# EasyEDA Pro project 平衡小车源文件.epro

# Schematic Schematic1
Create Date: 2024-05-30; Page Name: P1; Project Name: 平衡小车; Schematic Name: Schematic1; Update Date: 2024-05-30; Company: 嘉立创EDA; Page Size: A4; Version: V1.0
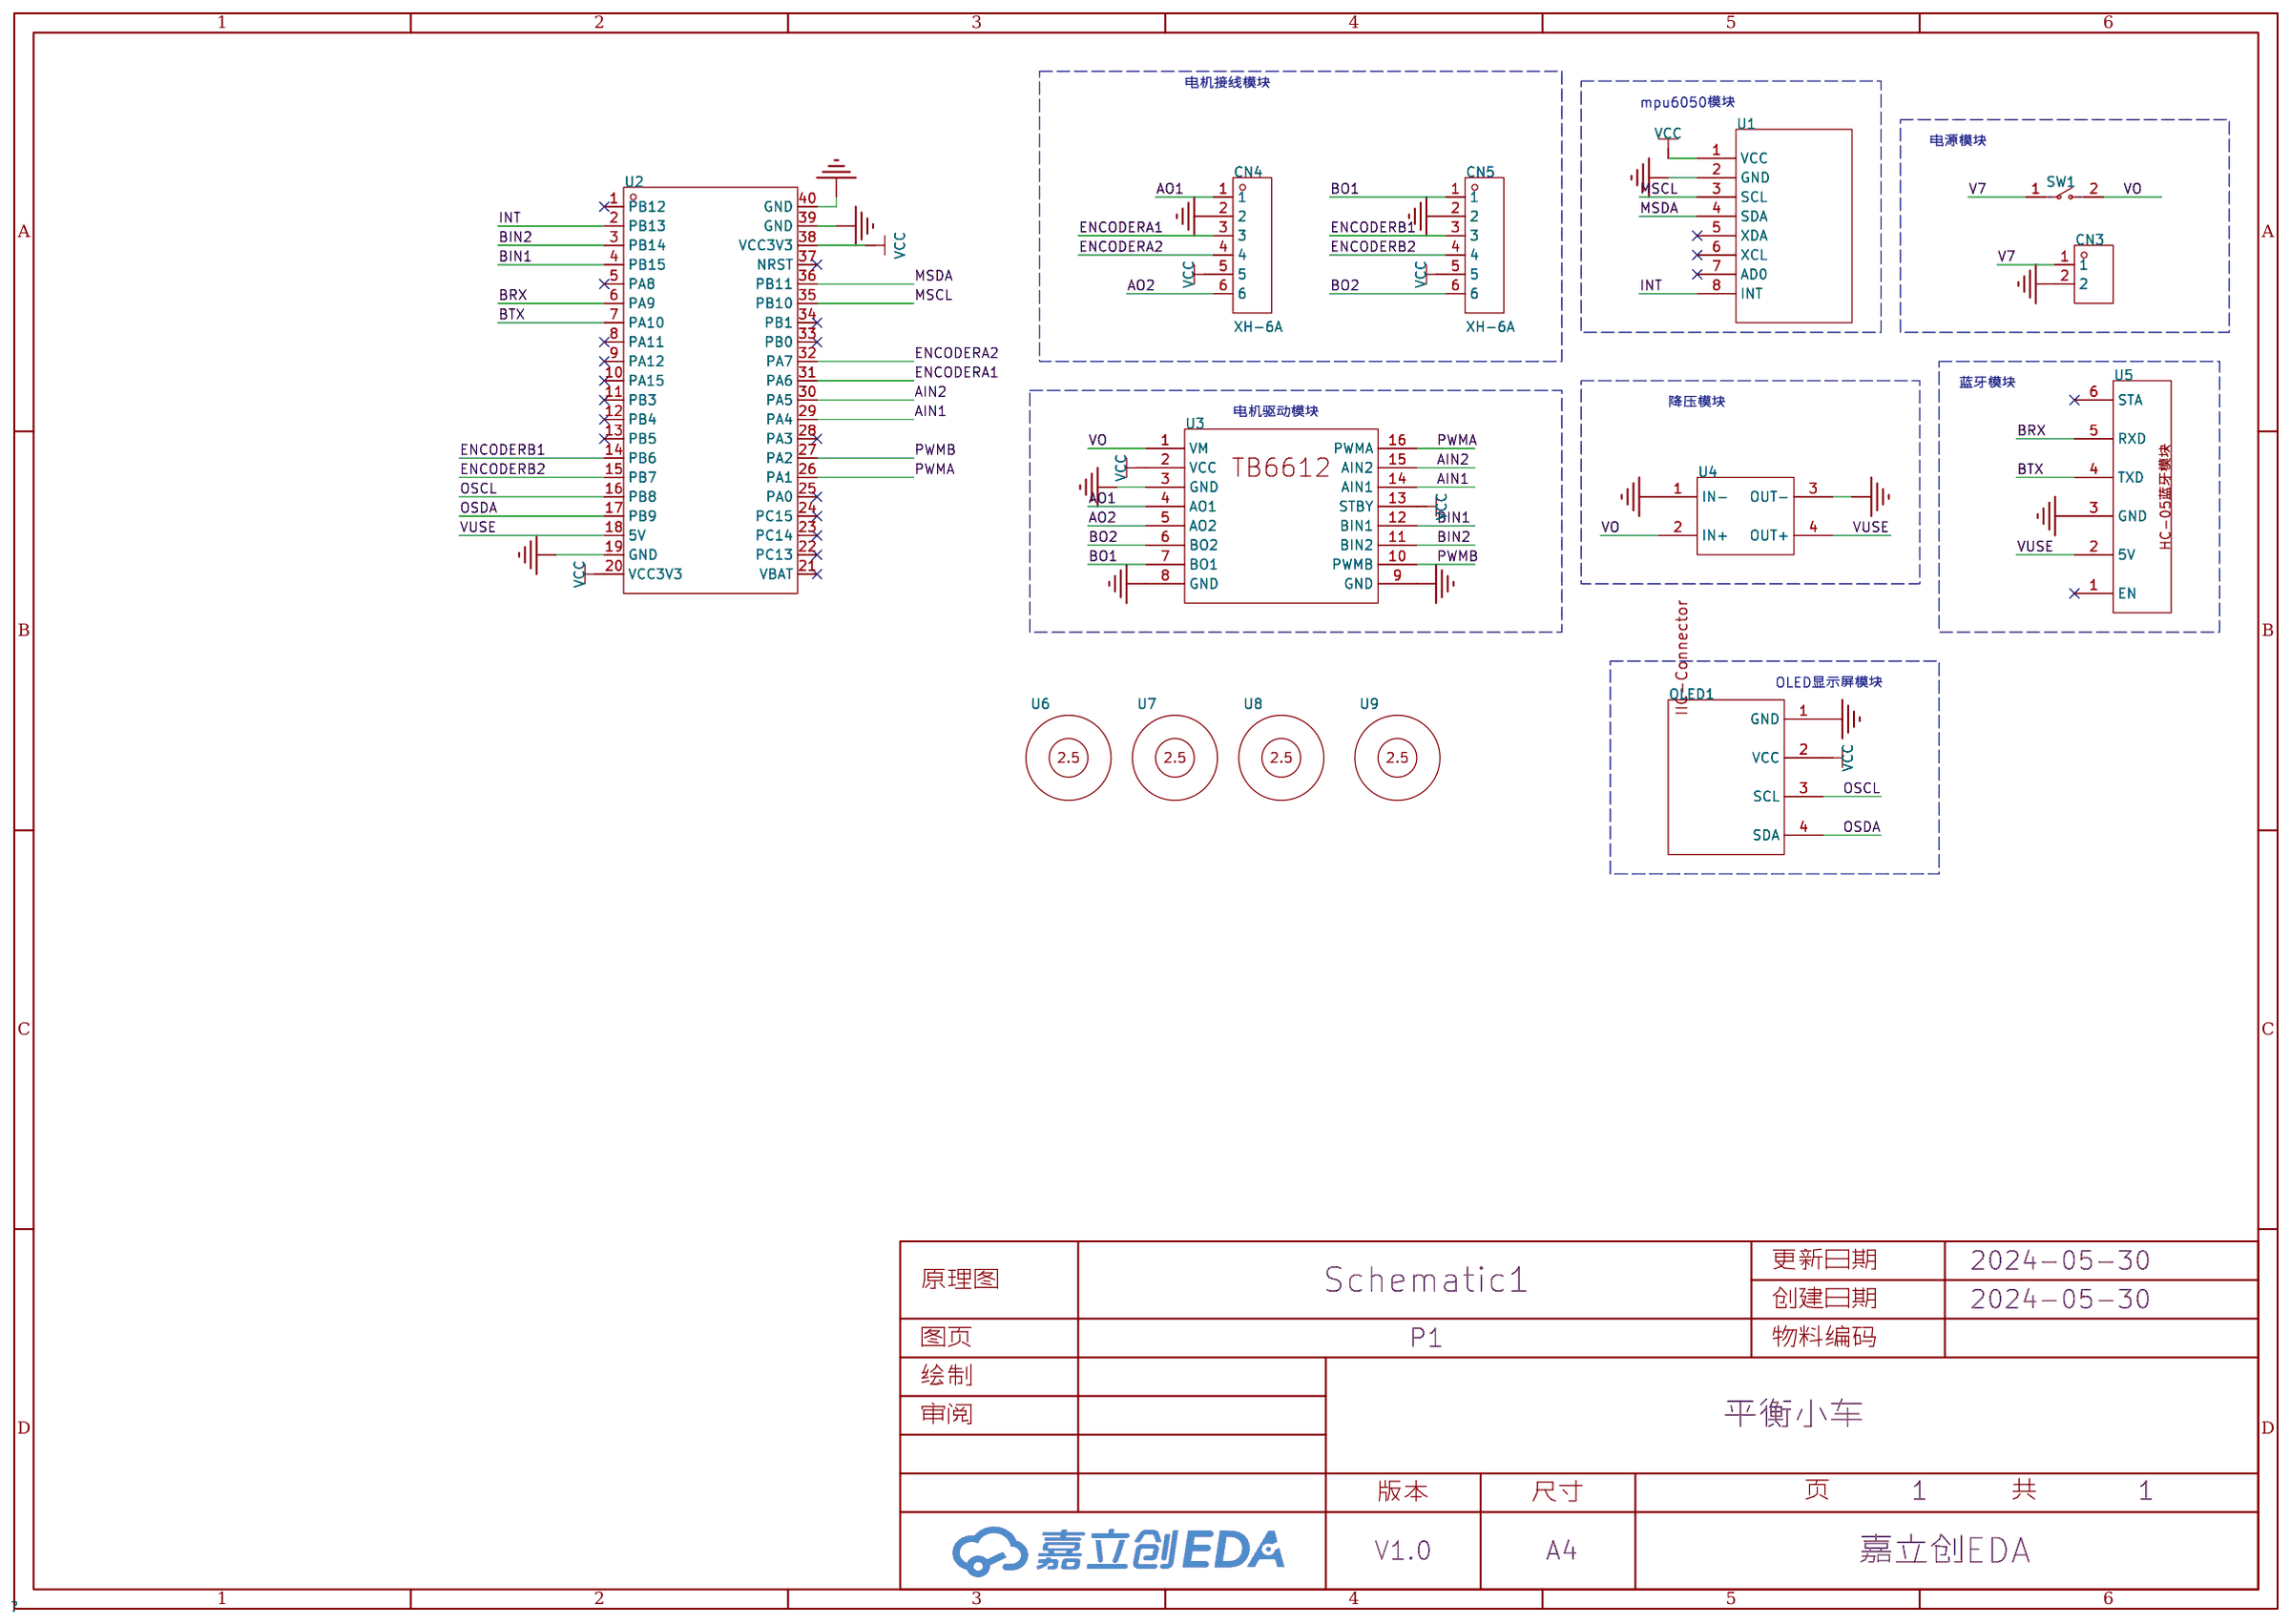
[diagram p0: schematic sheet]

## Parts
CN3  ZX-XH2.54-2PZZ  [CONN-TH_2P-P2.50_HX25003-2A]
CN4  XH-6A  [CONN-TH_6P-P2.50_HCTL_XH-6A_C2908604]
CN5  XH-6A  [CONN-TH_6P-P2.50_HCTL_XH-6A_C2908604]
OLED1  0.96OLED_4P_MODULE_JX  [0.96OLED_4P]
SW1  KCD11-2P-R  [SW-TH_2P-L15.0-W10.5-P5.00_KCD11-2P-R]
U1  -  [Module-MPU6050]
U2  STM32F103C8T6-Card  [CONN-TH_L53.3-W22.9_STM32F103C8T6-CARD]
U3  -  [TB6612电机驱动模块]
U4  -  [MP1548EN可调电源模块]
U5  -  [HC05蓝牙模块]
U6  -  [HM_孔_M2.5]
U7  -  [HM_孔_M2.5]
U8  -  [HM_孔_M2.5]
U9  -  [HM_孔_M2.5]

## Library data of the parts
CN3 = ZX-XH2.54-2PZZ: 插针结构:1x2P;间距:2.54mm;安装方式:直插;参考系列:XH;总PIN数:2P;排数:1;每排PIN数:2;行距:-;额定电流:3A;触头材质:黄铜;触头镀层:锡;工作温度范围:-25℃~+85℃;; Supplier Part: C7429632; Manufacturer: Megastar(兆星); Supplier Footprint: 插件,P=2.54mm; JLCPCB Part Class: 扩展库; Datasheet: https://atta.szlcsc.com/upload/public/pdf/source/20230619/19BA6947230AA44A04D3EDD65E618FD0.pdf; Supplier: LCSC; Pins Structure: 1x2P; Pitch: 2.54mm; Mounting Style: 直插; Reference Series: XH; Number of Pins: 2P; Number of Rows: 1; Number of PINs Per Row: 2; Current Rating (Max): 3A; Contact Material: 黄铜; Contact Plating: 锡; Operating Temperature Range: -25℃~+85℃
CN4 CN5 = XH-6A: 插针结构:1x6P;间距:2.5mm;安装方式:直插;参考系列:XH;总PIN数:6P;排数:1;每排PIN数:6;行距:-;额定电流:3A;触头材质:黄铜;触头镀层:锡;工作温度范围:-25℃~+85℃;; LCSC Part Name: 1x6P 间距:2.5mm 直插 系列:XH; Supplier Part: C2908604; Manufacturer: HCTL(华灿天禄); Supplier Footprint: 插件,P=2.5mm; JLCPCB Part Class: 扩展库; Datasheet: https://atta.szlcsc.com/upload/public/pdf/source/20230711/68D365716984B4AFE576D1D73D61B465.pdf; Supplier: LCSC; Pins Structure: 1x6P; Pitch: 2.5mm; Mounting Style: 直插; Reference Series: XH; Number of Pins: 6P; Number of Rows: 1; Number of PINs Per Row: 6; Current Rating (Max): 3A; Contact Material: 黄铜; Contact Plating: 锡; Operating Temperature Range: -25℃~+85℃
OLED1 = 0.96OLED_4P_MODULE_JX: Supplier Part: C9900004566; Supplier Footprint: 插件; JLCPCB Part Class: 扩展库; Supplier: LCSC
SW1 = KCD11-2P-R: 带灯:无;引脚样式:焊片;额定电流:3A;额定电压(AC):250V;额定电压(DC):-;电路结构:单刀单掷;机械寿命:1万次;; LCSC Part Name: 10.5*15mm 两脚两档跷板开关 红钮; Supplier Part: C5884414; Manufacturer: SHOU HAN(首韩); Supplier Footprint: 插件; JLCPCB Part Class: 扩展库; Datasheet: https://atta.szlcsc.com/upload/public/pdf/source/20230506/CD06DFDE35C8048D34175BFF4AF6A2C2.pdf; Supplier: LCSC; Switch Length: 15mm; Switch Width: 10.5mm; Switch Height: 17.2mm; Actuator Type: 凹面弯曲; With Lamp: 无; Pin Style: 焊片; Actuator Color: 红色; Contact Current: 3A; Voltage Rating (AC): 250V; Circuit: 单刀单掷; Mechanical Life: 1万次; Operating Temperature: 0℃~+125℃; Actuator Identifier: - O
U1 = MPU6050模块
U2 = STM32F103C8T6-Card: Supplier Part: C9900077949; Supplier Footprint: 插件; Supplier: LCSC
U3 = TB6612电机驱动模块
U4 = MP1584EN可调电源降压模块: 输入4.5-28V；输出0.8-20V，Max3A；尺寸22*17*4mm; Manufacturer: 淘宝zave旗舰店
U5 = HC05蓝牙模块: _: 3
U6-U9 = HM_孔_M2.5: _: 3

## Nets
GND: CN3.2 CN4.2 CN5.2 OLED1.1(GND) U1.2(GND) U2.19(GND) U2.39(GND) U2.40(GND) U3.3(GND) U3.8(GND) U3.9(GND) U4.1(IN-) U4.3(OUT-) U5.3(GND)
V7: CN3.1 SW1.1
VCC: CN4.5 CN5.5 OLED1.2(VCC) U1.1(VCC) U2.20(VCC3V3) U2.38(VCC3V3) U3.2(VCC) U3.13(STBY)
AIN1: U2.29(PA4) U3.14(AIN1)
AIN2: U2.30(PA5) U3.15(AIN2)
AO1: CN4.1 U3.4(AO1)
AO2: CN4.6 U3.5(AO2)
BIN1: U2.4(PB15) U3.12(BIN1)
BIN2: U2.3(PB14) U3.11(BIN2)
BO1: CN5.1 U3.7(BO1)
BO2: CN5.6 U3.6(BO2)
BRX: U2.6(PA9) U5.5(RXD)
BTX: U2.7(PA10) U5.4(TXD)
ENCODERA1: CN4.3 U2.31(PA6)
ENCODERA2: CN4.4 U2.32(PA7)
ENCODERB1: CN5.3 U2.14(PB6)
ENCODERB2: CN5.4 U2.15(PB7)
INT: U1.8(INT) U2.2(PB13)
MSCL: U1.3(SCL) U2.35(PB10)
MSDA: U1.4(SDA) U2.36(PB11)
OSCL: OLED1.3(SCL) U2.16(PB8)
OSDA: OLED1.4(SDA) U2.17(PB9)
PWMA: U2.26(PA1) U3.16(PWMA)
PWMB: U2.27(PA2) U3.10(PWMB)
VO: SW1.2 U3.1(VM) U4.2(IN+)
VUSE: U2.18(5V) U4.4(OUT+) U5.2(5V)

Not connected (* = marked no-connect by the designer): U1 5(XDA)* 6(XCL)* 7(AD0)*; U2 1(PB12)* 5(PA8)* 8(PA11)* 9(PA12)* 10(PA15)* 11(PB3)* 12(PB4)* 13(PB5)* 21(VBAT)* 22(PC13)* 23(PC14)* 24(PC15)* 25(PA0)* 28(PA3)* 33(PB0)* 34(PB1)* 37(NRST)*; U5 1(EN)* 6(STA)*

## Notes on the sheet
- 电机接线模块
- mpu6050模块
- 电源模块
- 降压模块
- 蓝牙模块
- 电机驱动模块
- OLED显示屏模块

# Schematic Schematic2
Create Date: 2024-05-30; Page Name: P1; Project Name: 平衡小车; Schematic Name: Schematic2; Update Date: 2024-05-30; Company: 嘉立创EDA; Page Size: A4; Version: V1.0
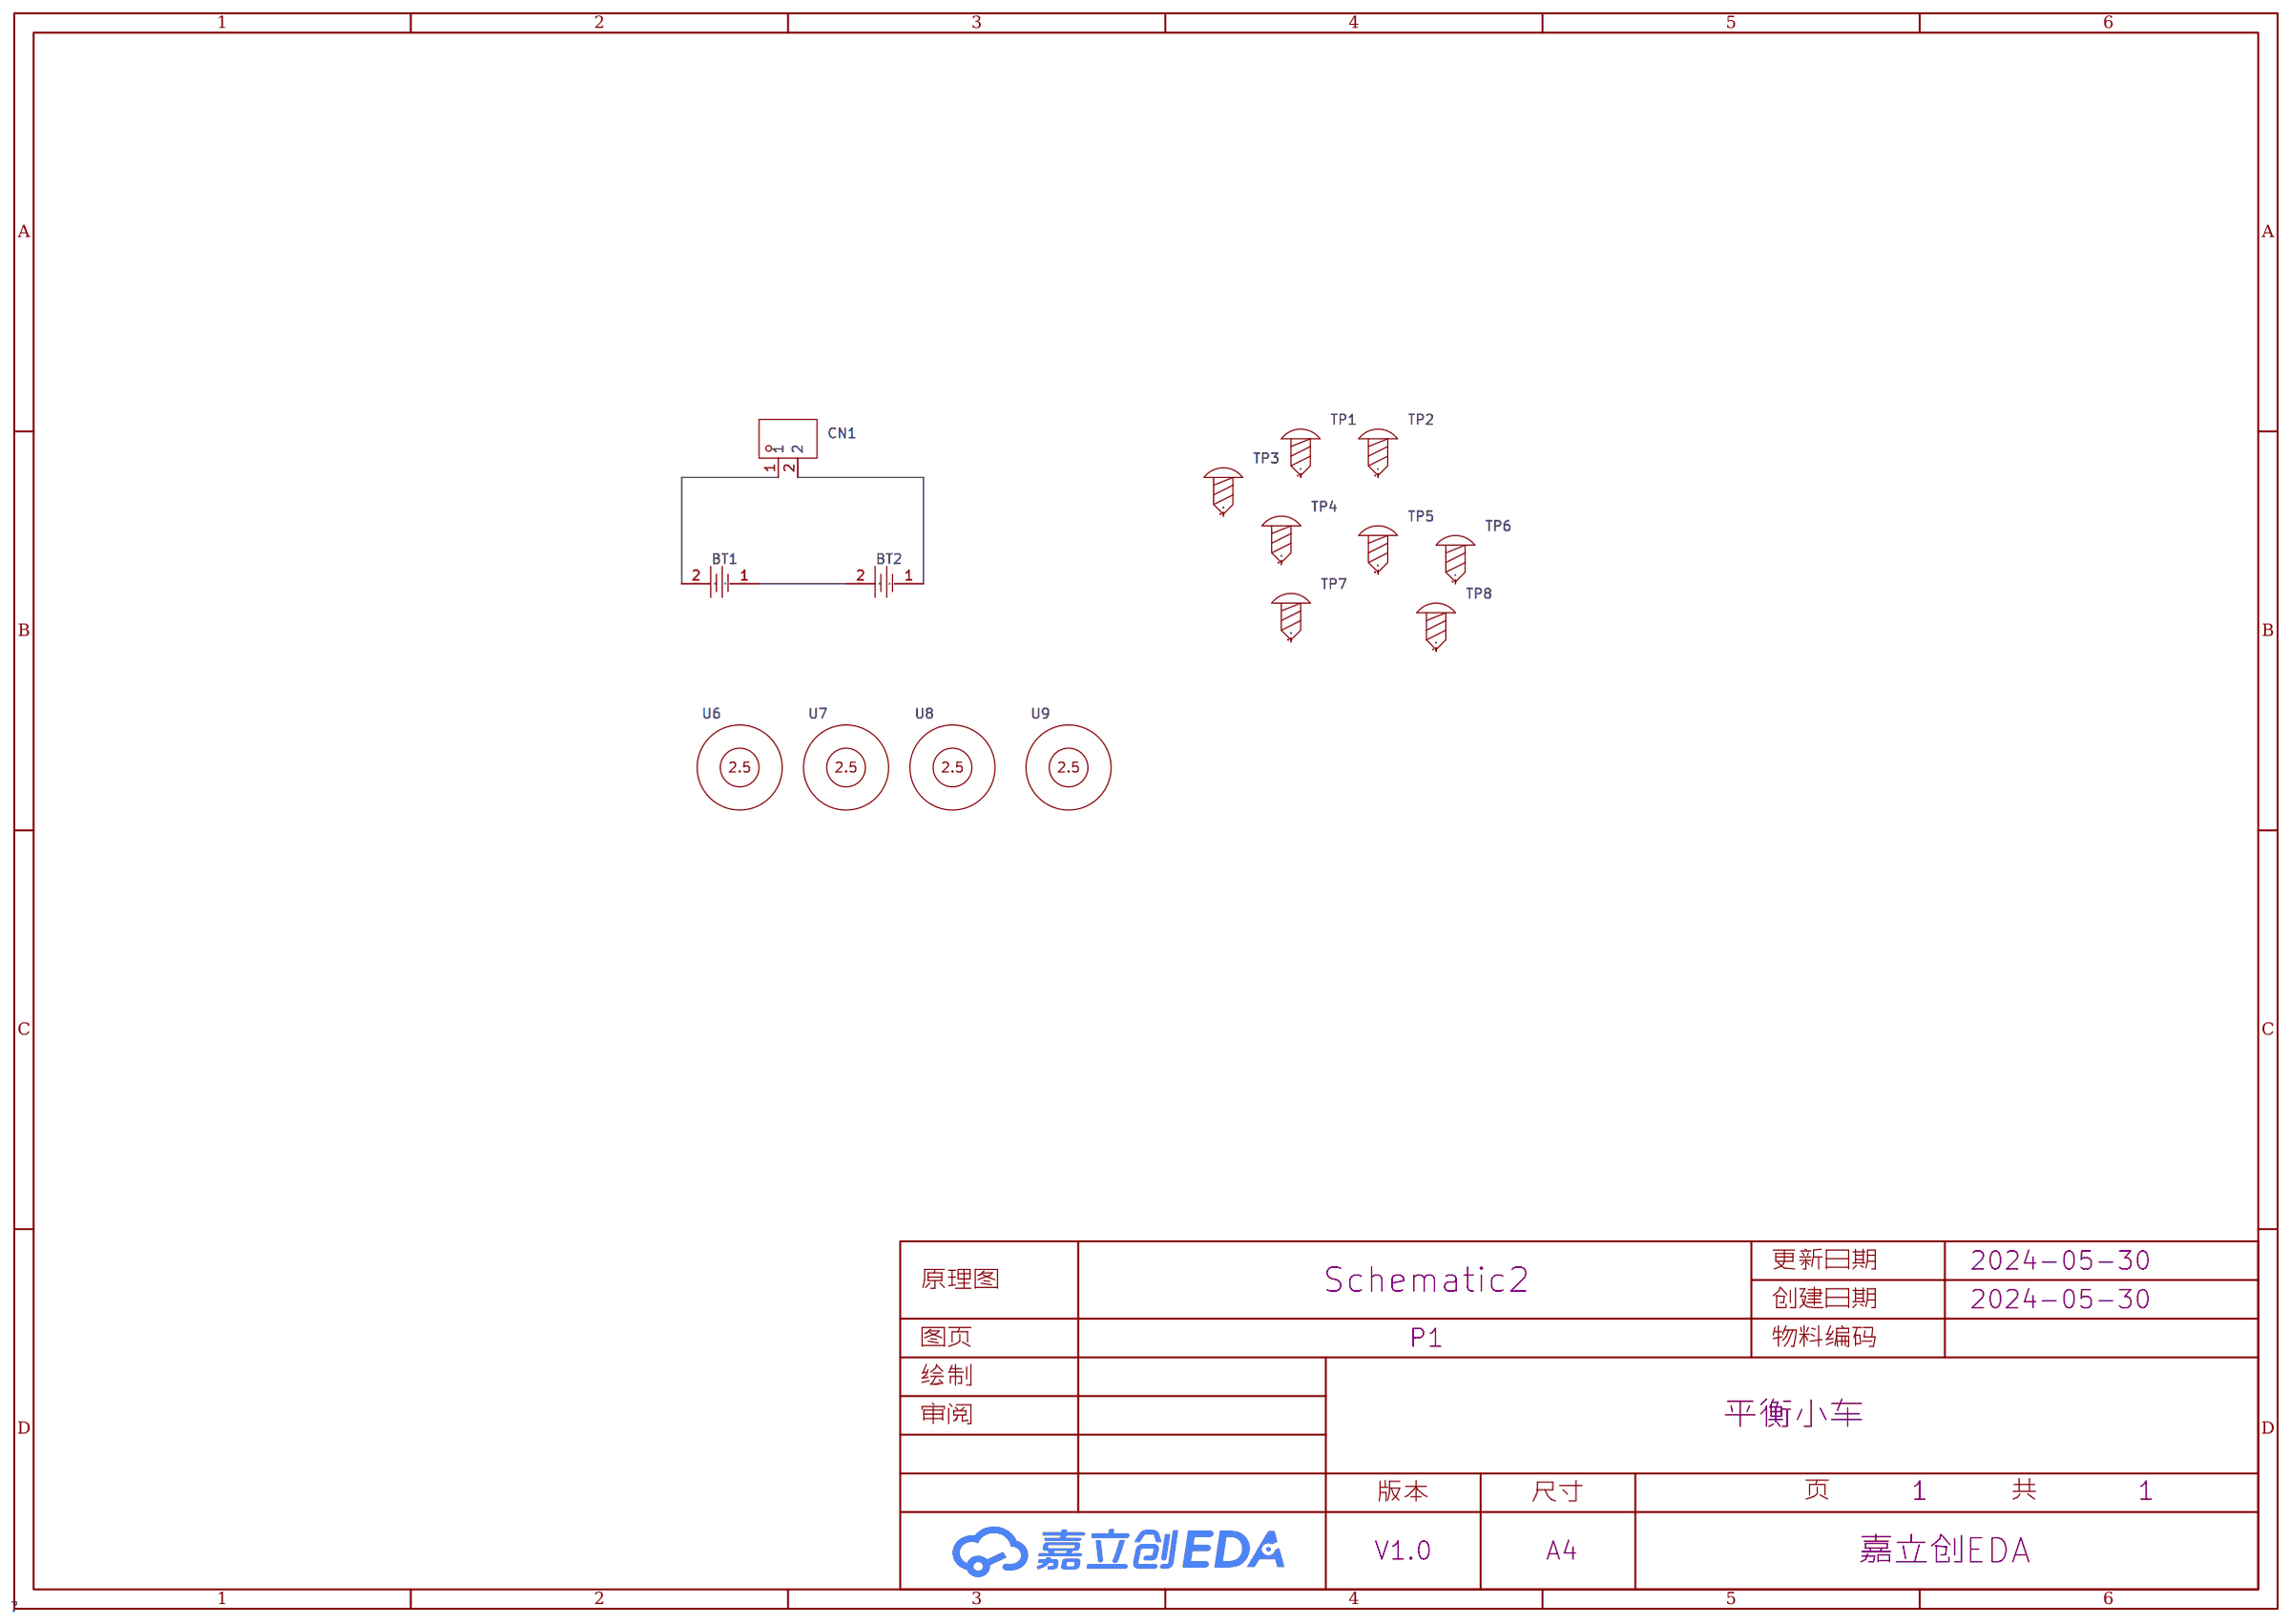
[diagram p1: schematic sheet]

## Parts
BT1  BH-18650-A1AJ005  [BAT-TH_BH-18650-A1AJ005]
BT2  BH-18650-A1AJ005  [BAT-TH_BH-18650-A1AJ005]
CN1  ZX-XH2.54-2PZZ  [CONN-TH_2P-P2.50_HX25003-2A]
TP1  -  [M3螺丝]
TP2  -  [M3螺丝]
TP3  -  [M3螺丝]
TP4  -  [M3螺丝]
TP5  -  [M3螺丝]
TP6  -  [M3螺丝]
TP7  -  [M3螺丝]
TP8  -  [M3螺丝]
U6  -  [HM_孔_M2.5]
U7  -  [HM_孔_M2.5]
U8  -  [HM_孔_M2.5]
U9  -  [HM_孔_M2.5]

## Library data of the parts
BT1 BT2 = BH-18650-A1AJ005: 连接器类型:电池盒;适用电池规格:18650;; LCSC Part Name: 电池盒 适用电池:18650; Supplier Part: C5290176; Manufacturer: MYOUNG(美阳); Datasheet: https://atta.szlcsc.com/upload/public/pdf/source/20221129/D0CEC1B107B5F52E469FD9B49033E00F.pdf; Supplier: LCSC; Connector Type: 电池盒; Battery Type: 18650
CN1 = ZX-XH2.54-2PZZ: 插针结构:1x2P;间距:2.54mm;安装方式:直插;参考系列:XH;总PIN数:2P;排数:1;每排PIN数:2;行距:-;额定电流:3A;触头材质:黄铜;触头镀层:锡;工作温度范围:-25℃~+85℃;; Supplier Part: C7429632; Manufacturer: Megastar(兆星); Supplier Footprint: 插件,P=2.54mm; JLCPCB Part Class: 扩展库; Datasheet: https://atta.szlcsc.com/upload/public/pdf/source/20230619/19BA6947230AA44A04D3EDD65E618FD0.pdf; Supplier: LCSC; Pins Structure: 1x2P; Pitch: 2.54mm; Mounting Style: 直插; Reference Series: XH; Number of Pins: 2P; Number of Rows: 1; Number of PINs Per Row: 2; Current Rating (Max): 3A; Contact Material: 黄铜; Contact Plating: 锡; Operating Temperature Range: -25℃~+85℃
TP1-TP8 = 螺丝孔: Supplier Footprint: 插件
U6-U9 = HM_孔_M2.5: _: 3

## Nets
$1N217: BT1.1 BT2.2
$1N228: BT1.2 CN1.1
$1N232: BT2.1 CN1.2

Not connected (* = marked no-connect by the designer): TP1 1; TP2 1; TP3 1; TP4 1; TP5 1; TP6 1; TP7 1; TP8 1

# Board PCB2
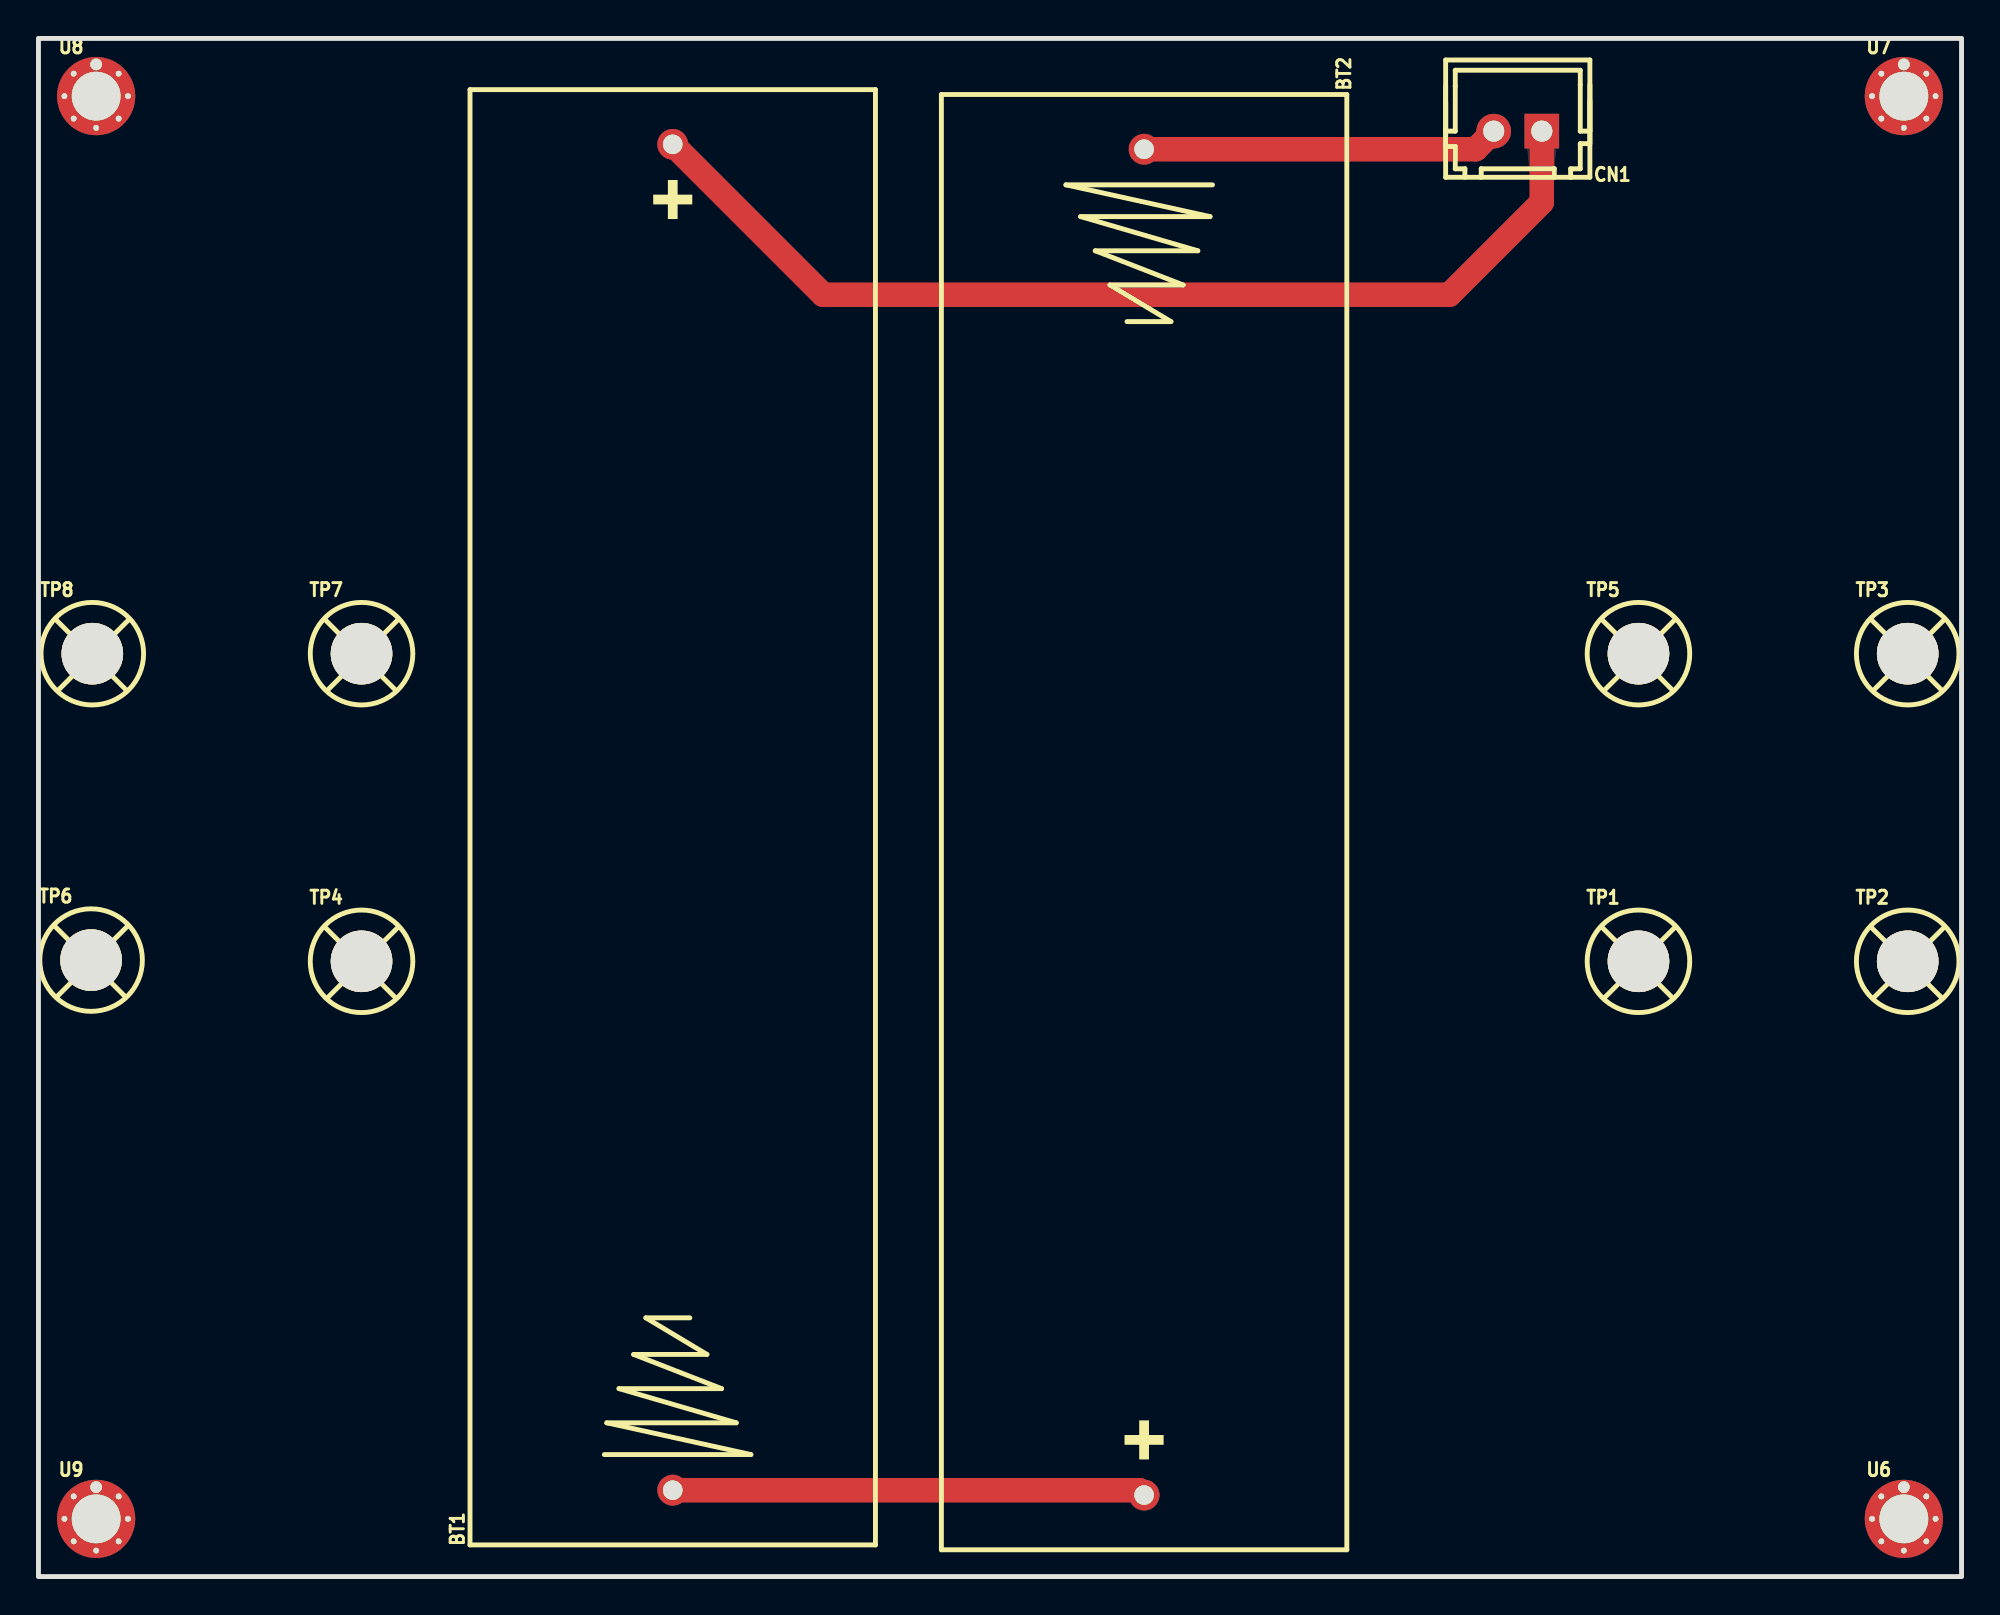
[diagram p2: board, top side]
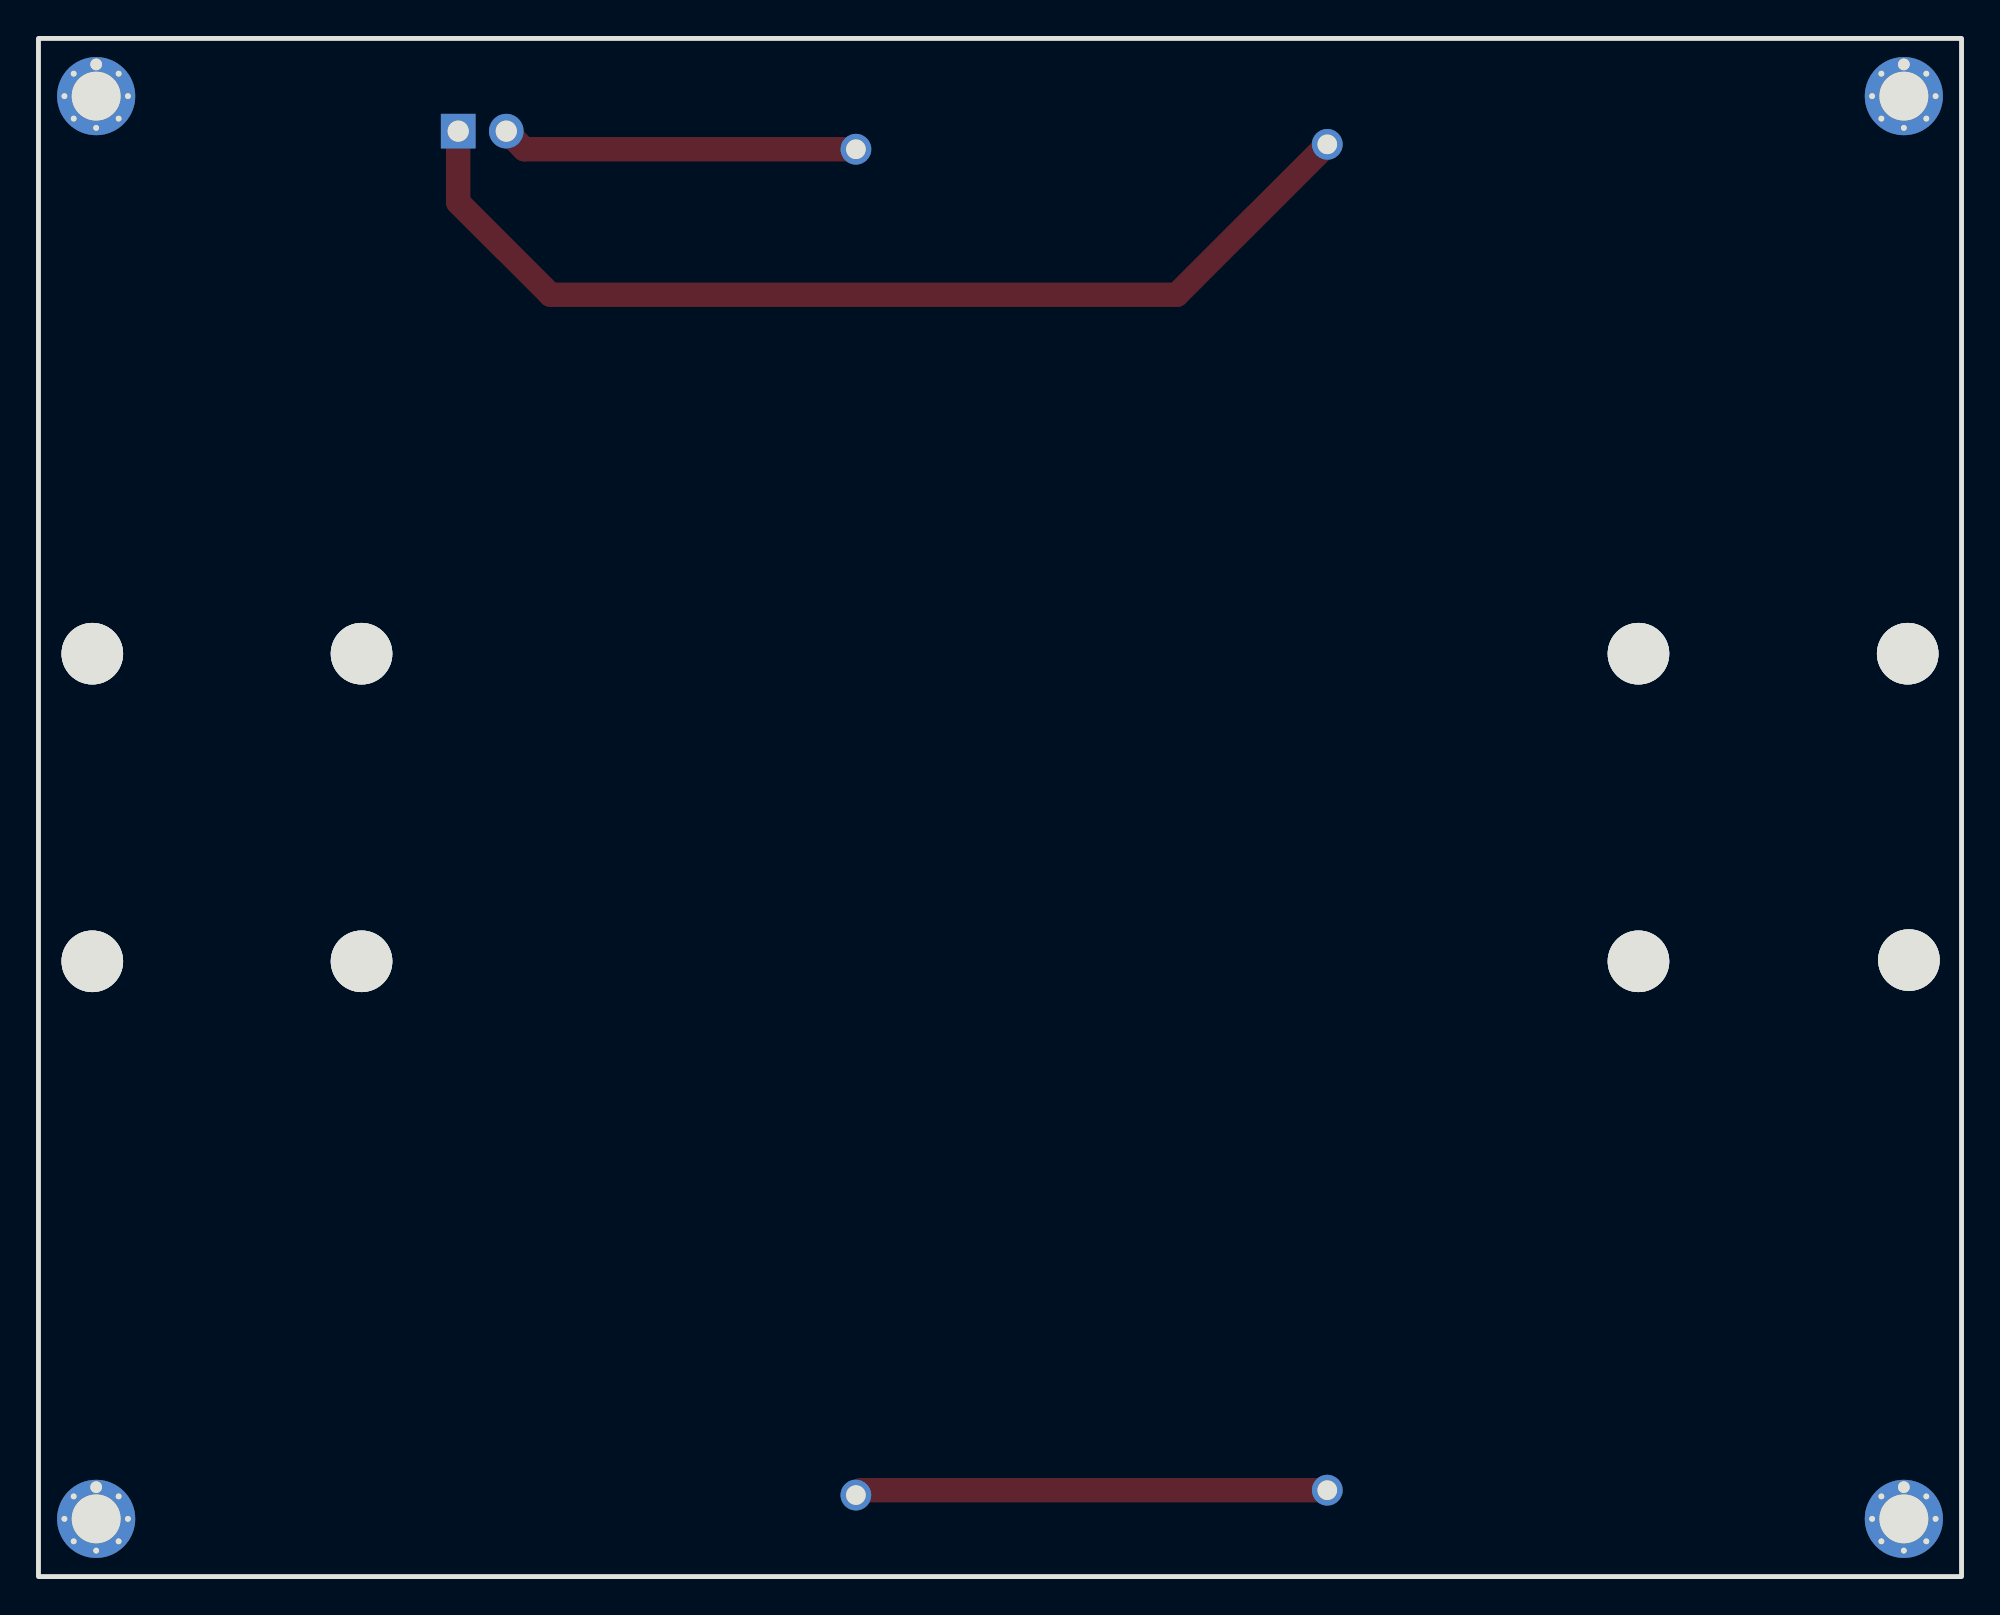
[diagram p3: board, bottom side, seen from below]

Outline 100 x 80 mm; copper layers: Top Layer, Bottom Layer. Coordinates in mm from the lower left corner of the outline.
Outline path: rectangle 0,80 100,0
Stack: Top Layer 0.035mm / Dielectric1 1.51mm FR4 er 4.5 / Bottom Layer 0.035mm

## Design rules (mm)
template: JLCPCB Capability(Two Layers Board)
spacing copperThickness1oz (default): track to track 0.102, other pairs 0.152 to 0.3
spacing copperThickness2oz: track to track 0.203, other pairs 0.152 to 0.3
track width copperThickness1oz (default): min 0.127, default 0.254, max 2.54
track width copperThickness2oz: min 0.203, default 0.254, max 2.54
differential pair differentialPair (default): width min 0.127, default 0.254, max 2.54; gap min 0.152, default 0.152
via viaSize (default): diameter min 0.5, default 0.61, max 10; hole min 0.3, default 0.305, max 6.3

## Placement (name value [footprint] x y rotation side)
BT1  BH-18650-A1AJ005  [BAT-TH_BH-18650-A1AJ005]  32.98 39.49 90 top
BT2  BH-18650-A1AJ005  [BAT-TH_BH-18650-A1AJ005]  57.49 39.24 270 top
CN1  ZX-XH2.54-2PZZ  [CONN-TH_2P-P2.50_HX25003-2A]  76.92 75.18 180 top
TP1  -  [M3螺丝]  83.26 31.94 0 top
TP2  -  [M3螺丝]  97.26 31.94 0 top
TP3  -  [M3螺丝]  97.26 47.94 0 top
TP4  -  [M3螺丝]  16.86 31.94 0 top
TP5  -  [M3螺丝]  83.26 47.94 0 top
TP6  -  [M3螺丝]  2.8 32 0 top
TP7  -  [M3螺丝]  16.86 47.94 0 top
TP8  -  [M3螺丝]  2.86 47.94 0 top
U6  -  [HM_孔_M2.5]  97 3 0 top
U7  -  [HM_孔_M2.5]  97 77 0 top
U8  -  [HM_孔_M2.5]  3 77 0 top
U9  -  [HM_孔_M2.5]  3 3 0 top

## Footprints (pads in the part's own frame, mm; a bottom-side part is the same pattern mirrored in y, then rotated)
BAT-TH_BH-18650-A1AJ005
  round 1.6 hole 1.02: 1(-35,0) 2(35,0)
CONN-TH_2P-P2.50_HX25003-2A
  rect 1.8x1.8 hole 1.1: 1(-1.25,0)
  round 1.8 hole 1.1: 2(1.25,0)
HM_孔_M2.5
  round 0.61 hole 0.305: 1(-1.651,0) 1(-1.169,1.169) 1(-1.169,-1.169) 1(0,-1.651) 1(1.169,1.169) 1(1.169,-1.169) 1(1.651,0)
  round 0.61 hole 2.54x0.305: 1(0,1.651)
  round 4.064 hole 2.54: 1(0,0)
M3螺丝
  round 3.2 hole 3.2: 1(-0.064,0.064)

## Nets
As in the schematic.

Pads without a net: TP1 1; TP2 1; TP3 1; TP4 1; TP5 1; TP6 1; TP7 1; TP8 1; U6 1; U7 1; U8 1; U9 1

## Routing (per net, layer and track width the routed paths; a pad name or vN(x,y) marks a point on that pad's centre or on a via; arc(x,y) is an arc through that point)
$1N217: length 24.6
  Top Layer w1.27: BT1.1 57.24,4.49 BT2.2
$1N228: length 54.1
  Top Layer w1.27: CN1.1 78.17,71.48 73.37,66.67 40.8,66.67 BT1.2
$1N232: length 18.6
  Top Layer w1.27: BT2.1 74.73,74.24 CN1.2

## Copper pours and planes (outline as drawn; the poured copper is in the pictures)
$1N217 on Top Layer: -87.67,84.32 166.33,84.32 166.33,-5.59 -87.67,-5.59
$1N217 on Bottom Layer: -3.72,120.39 110.45,120.39 110.45,-28.58 -3.72,-28.58

Small or netless copper shapes (teardrops, artwork), in the pictures only: 2 on Top Layer

# Board PCB1
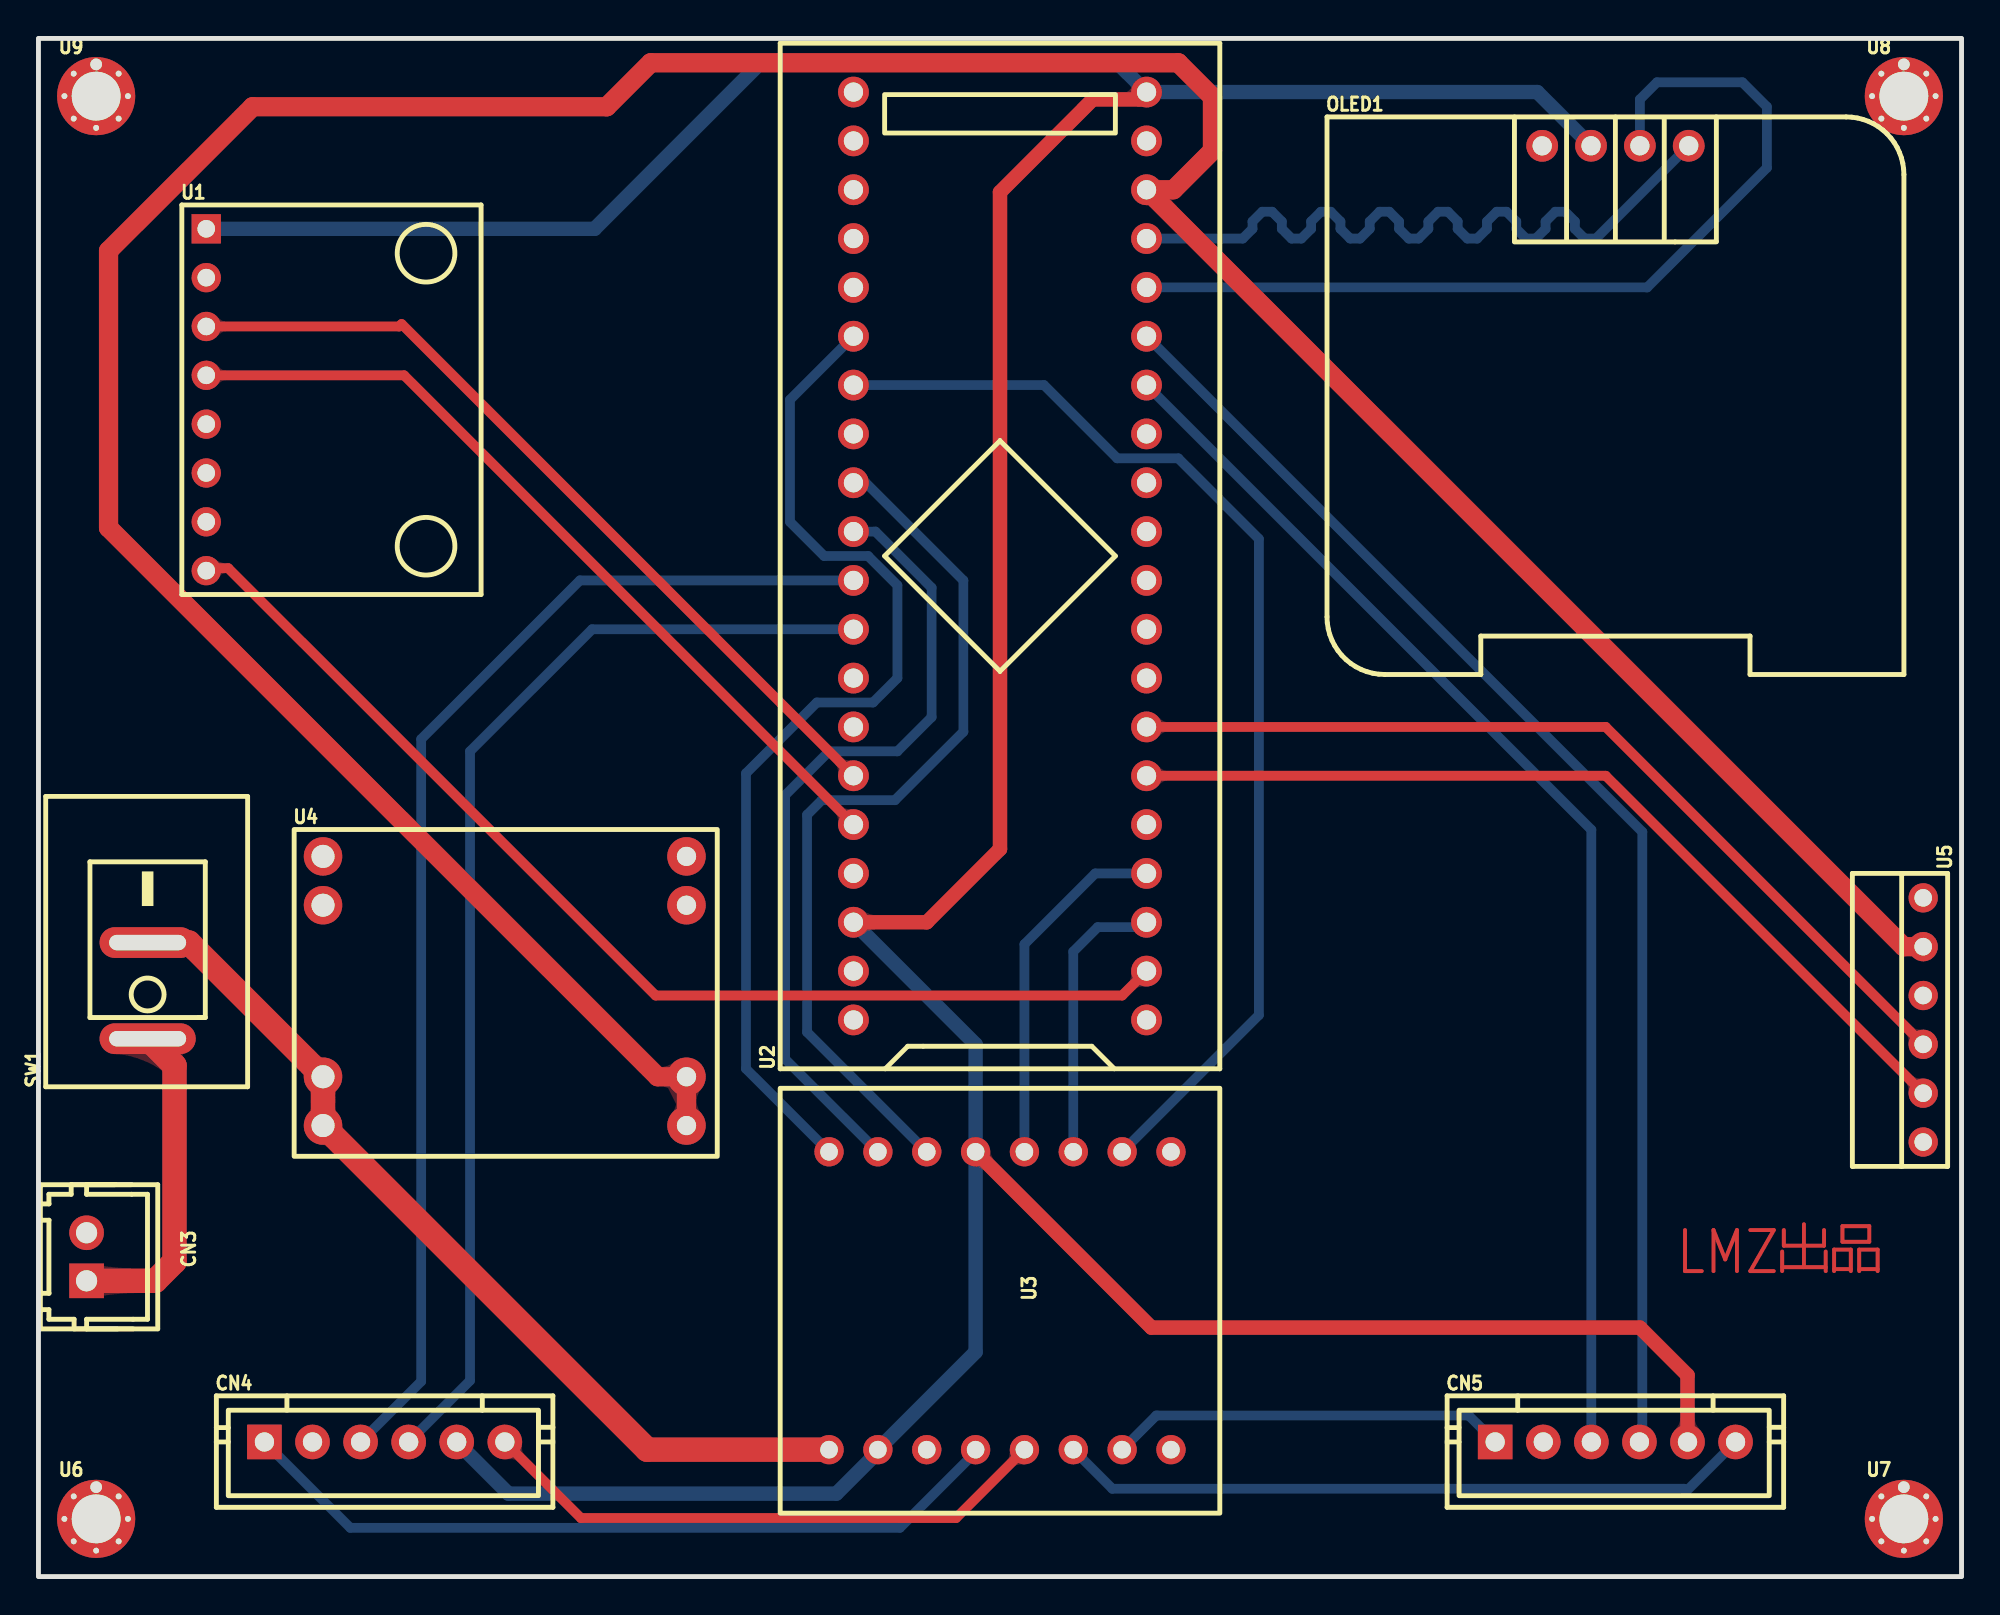
[diagram p4: board, top side]
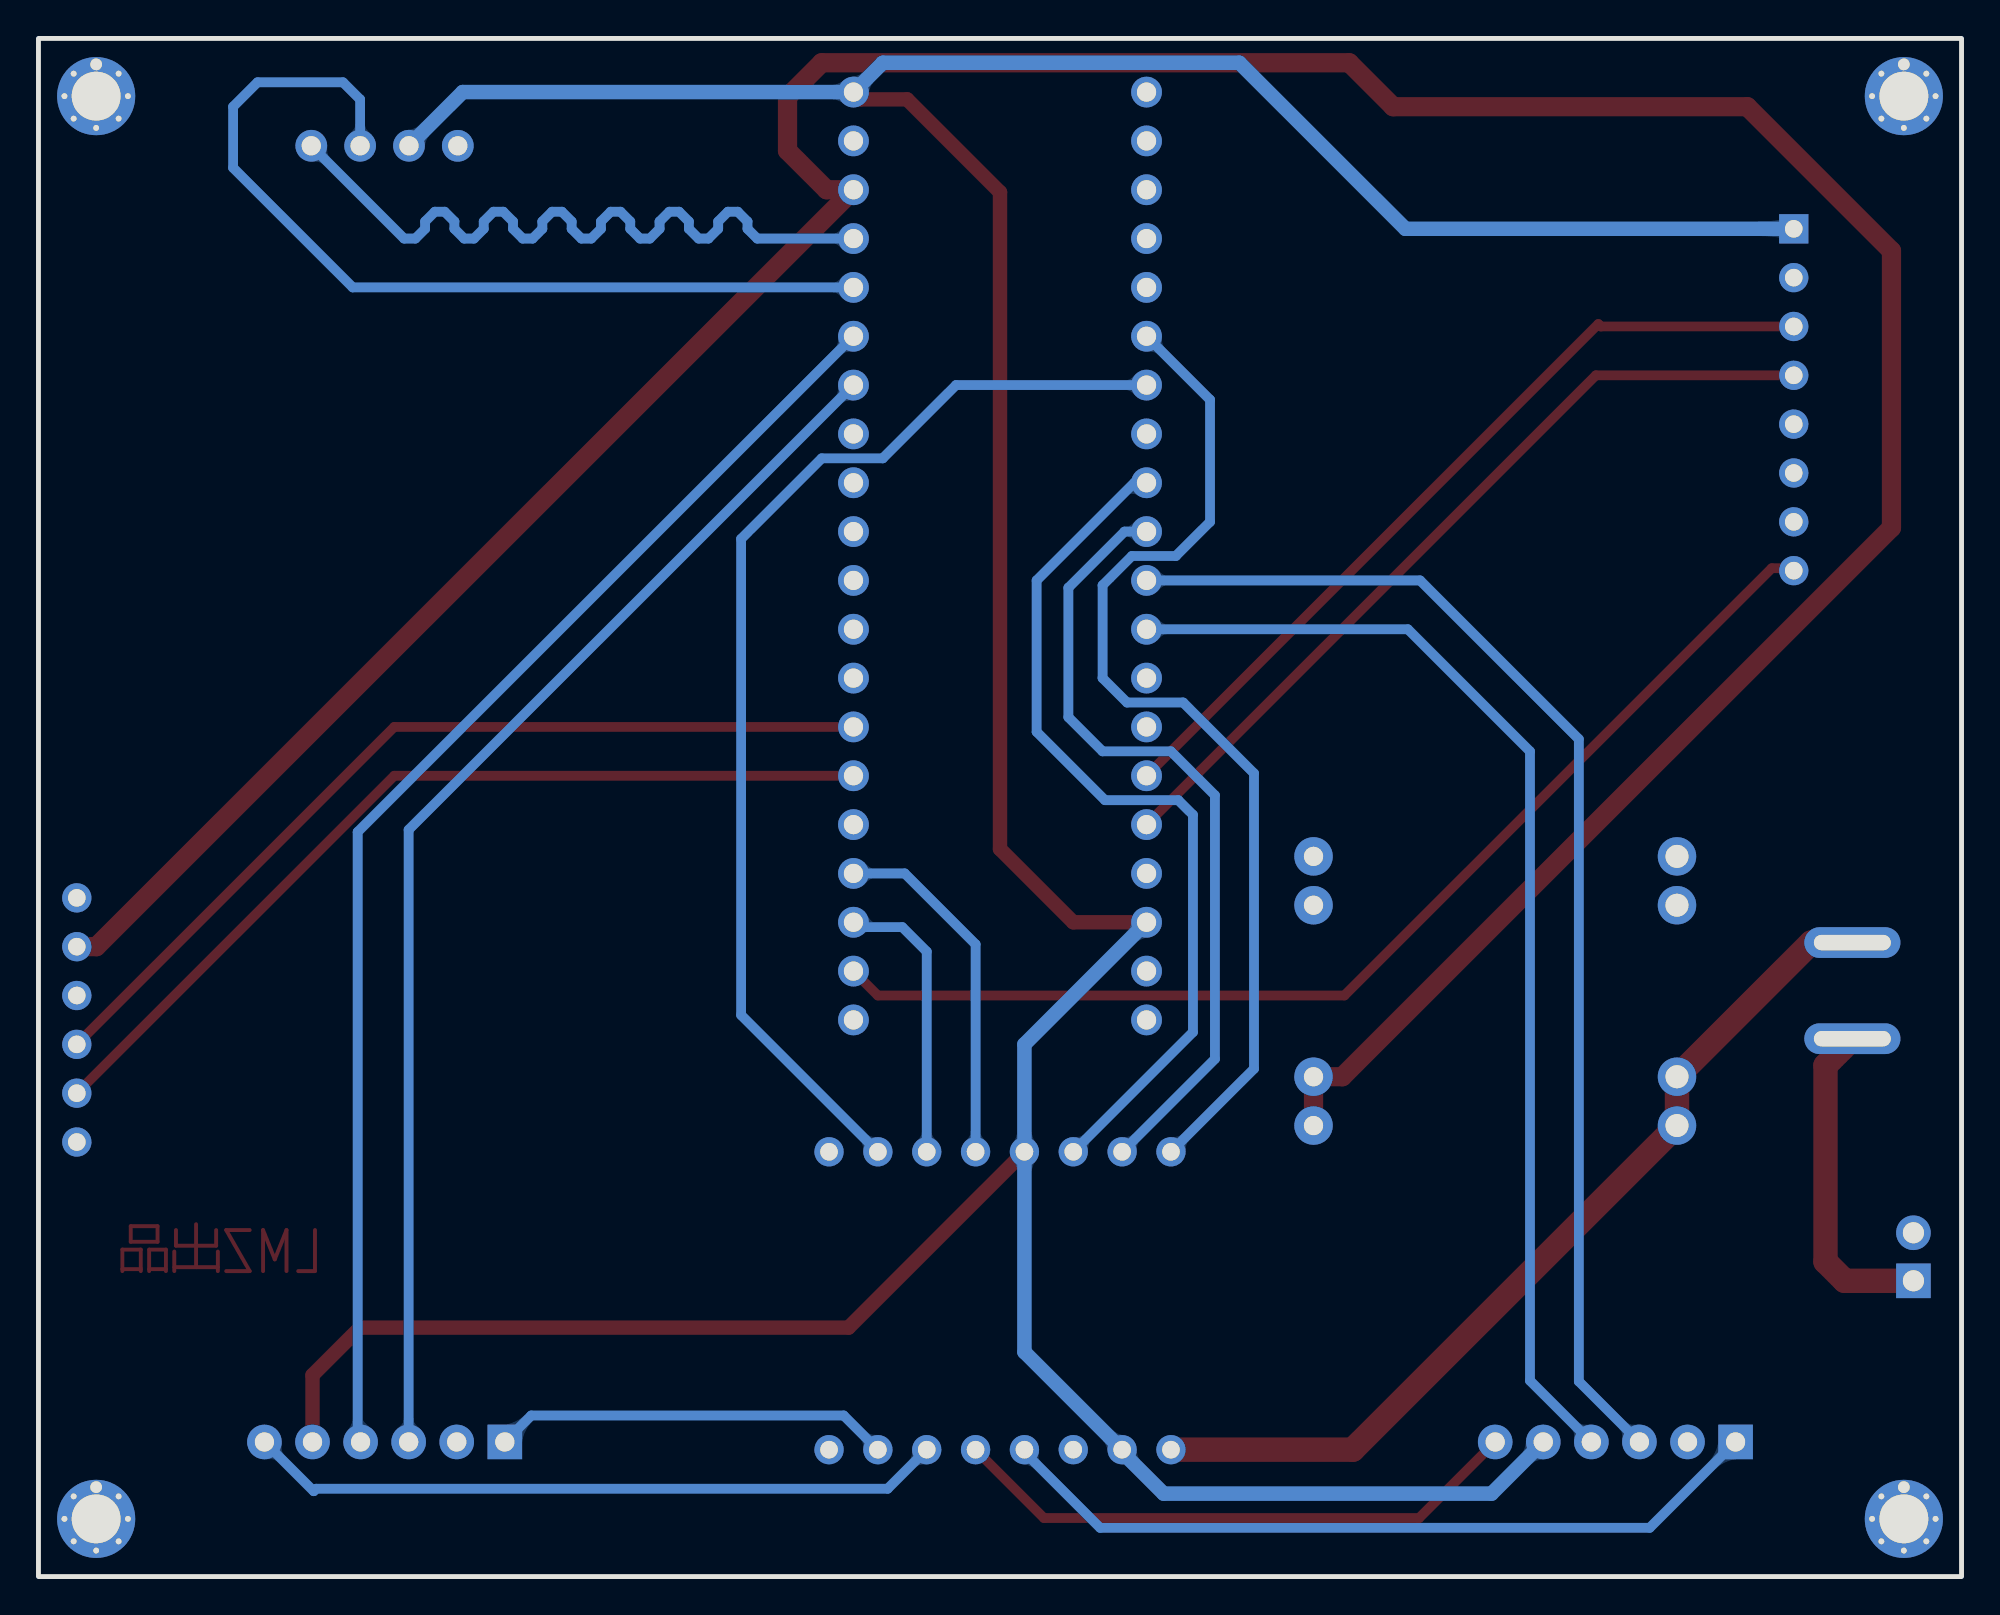
[diagram p5: board, bottom side, seen from below]

Outline 100 x 80 mm; copper layers: Top Layer, Bottom Layer. Coordinates in mm from the lower left corner of the outline.
Outline path: rectangle 0,80 100,0
Stack: Top Layer 0.035mm - / Dielectric1 1.51mm FR4 er 4.5 / Bottom Layer 0.035mm -

## Design rules (mm)
template: JLCPCB Capability(Two Layers Board)
spacing copperThickness1oz (default): track to track 0.102, other pairs 0.152 to 0.3
spacing copperThickness2oz: track to track 0.203, other pairs 0.152 to 0.3
track width copperThickness1oz (default): min 0.127, default 0.254, max 2.54
track width copperThickness2oz: min 0.203, default 0.254, max 2.54
differential pair differentialPair (default): width min 0.127, default 0.254, max 2.54; gap min 0.152, default 0.152
via viaSize (default): diameter min 0.5, default 0.61, max 10; hole min 0.3, default 0.305, max 6.3

## Placement (name value [footprint] x y rotation side)
CN3  ZX-XH2.54-2PZZ  [CONN-TH_2P-P2.50_HX25003-2A]  2.5 16.63 90 top
CN4  XH-6A  [CONN-TH_6P-P2.50_HCTL_XH-6A_C2908604]  18 7 0 top
CN5  XH-6A  [CONN-TH_6P-P2.50_HCTL_XH-6A_C2908604]  82 7 0 top
OLED1  0.96OLED_4P_MODULE_JX  [0.96OLED_4P]  82 74.42 0 top
SW1  KCD11-2P-R  [SW-TH_2P-L15.0-W10.5-P5.00_KCD11-2P-R]  5.68 30.47 90 top
U1  -  [Module-MPU6050]  13.81 62.48 0 top
U2  STM32F103C8T6-Card  [CONN-TH_L53.3-W22.9_STM32F103C8T6-CARD]  50 53.08 90 top
U3  -  [TB6612电机驱动模块]  50 14.35 90 top
U4  -  [MP1548EN可调电源模块]  13.3 38.86 0 top
U5  -  [HC05蓝牙模块]  96.99 28.95 270 top
U6  -  [HM_孔_M2.5]  3 3 0 top
U7  -  [HM_孔_M2.5]  97 3 0 top
U8  -  [HM_孔_M2.5]  97 77 0 top
U9  -  [HM_孔_M2.5]  3 77 0 top

## Footprints (pads in the part's own frame, mm; a bottom-side part is the same pattern mirrored in y, then rotated)
0.96OLED_4P
  round 1.65 hole 1: 1(-3.81,-0.002) 2(-1.27,0.002) 3(1.27,0.002) 4(3.81,0.002)
CONN-TH_2P-P2.50_HX25003-2A
  rect 1.8x1.8 hole 1.1: 1(-1.25,0)
  round 1.8 hole 1.1: 2(1.25,0)
CONN-TH_6P-P2.50_HCTL_XH-6A_C2908604
  rect 1.8x1.8 hole 1: 1(-6.25,0.001)
  round 1.8 hole 1: 2(-3.749,0.001) 3(-1.25,0.001) 4(1.25,0) 5(3.75,-0.001) 6(6.25,-0.001)
CONN-TH_L53.3-W22.9_STM32F103C8T6-CARD
  round 1.6 hole 1: 1(-24.13,-7.62) 2(-21.59,-7.62) 3(-19.05,-7.62) 4(-16.51,-7.62) 5(-13.97,-7.62) 6(-11.43,-7.62) 7(-8.89,-7.62) 8(-6.35,-7.62) 9(-3.81,-7.62) 10(-1.27,-7.62) 11(1.27,-7.62) 12(3.81,-7.62) 13(6.35,-7.62) 14(8.89,-7.62) 15(11.43,-7.62) 16(13.97,-7.62) 17(16.51,-7.62) 18(19.05,-7.62) 19(21.59,-7.62) 20(24.13,-7.62) 21(24.13,7.62) 22(21.59,7.62) 23(19.05,7.62) 24(16.51,7.62) 25(13.97,7.62) 26(11.43,7.62) 27(8.89,7.62) 28(6.35,7.62) 29(3.81,7.62) 30(1.27,7.62) 31(-1.27,7.62) 32(-3.81,7.62) 33(-6.35,7.62) 34(-8.89,7.62) 35(-11.43,7.62) 36(-13.97,7.62) 37(-16.51,7.62) 38(-19.05,7.62) 39(-21.59,7.62) 40(-24.13,7.62)
HC05蓝牙模块
  round 1.524 hole 0.914: 1(-6.35,1.016) 2(-3.81,1.016) 3(-1.27,1.016) 4(1.27,1.016) 5(3.81,1.016) 6(6.35,1.016)
HM_孔_M2.5
  round 0.61 hole 0.305: 1(-1.651,0) 1(-1.169,1.169) 1(-1.169,-1.169) 1(0,-1.651) 1(1.169,1.169) 1(1.169,-1.169) 1(1.651,0)
  round 0.61 hole 2.54x0.305: 1(0,1.651)
  round 4.064 hole 2.54: 1(0,0)
Module-MPU6050
  rect 1.524x1.524 hole 0.914: 1(-5.08,7.62)
  round 1.524 hole 0.914: 2(-5.08,5.08) 3(-5.08,2.54) 4(-5.08,0) 5(-5.08,-2.54) 6(-5.08,-5.08) 7(-5.08,-7.62) 8(-5.08,-10.16)
MP1548EN可调电源模块
  round 2 hole 1.2: 1(1.5,-1.4) 1(1.5,-3.94) 2(1.5,-12.86) 2(1.5,-15.4)
  round 2 hole 1: 3(20.4,-1.4) 3(20.4,-3.94) 4(20.4,-12.86) 4(20.4,-15.4)
SW-TH_2P-L15.0-W10.5-P5.00_KCD11-2P-R
  oval 1.6x5 hole 0.8x4: 1(-2.5,0) 2(2.5,0)
TB6612电机驱动模块
  round 1.524 hole 0.914: 1(-7.747,8.89) 2(-7.747,6.35) 3(-7.747,3.81) 4(-7.747,1.27) 5(-7.747,-1.27) 6(-7.747,-3.81) 7(-7.747,-6.35) 8(-7.747,-8.89) 9(7.747,-8.89) 10(7.747,-6.35) 11(7.747,-3.81) 12(7.747,-1.27) 13(7.747,1.27) 14(7.747,3.81) 15(7.747,6.35) 16(7.747,8.89)

## Nets
As in the schematic.

Pads without a net: U1 5 6 7; U2 1 5 8 9 10 11 12 13 21 22 23 24 25 28 33 34 37; U5 1 6; U6 1; U7 1; U8 1; U9 1

## Routing (per net, layer and track width the routed paths; a pad name or vN(x,y) marks a point on that pad's centre or on a via; arc(x,y) is an arc through that point)
V7: length 17.2
  Top Layer w1.27: CN3.1 6.08,15.38 7.07,16.38 7.07,26.58 SW1.1
VCC: length 232
  Top Layer w0.75: U2.20 57.24,76.83 54.83,76.83 50,72 50,37.84 46.19,34.03 U2.38 ; U3.13 57.87,12.95 83.27,12.95 85.75,10.47 CN5.5
  Bottom Layer w0.75: 8.72,70.1 28.92,70.1 37.55,78.73 56.1,78.73 U2.20 77.94,77.21 OLED1.2 ; U2.38 48.73,27.68 U3.13 48.73,11.68 U3.2 43.65,6.47 41.49,4.31 24.44,4.31 CN4.5
AIN1: length 45.7
  Bottom Layer w0.508: U3.14 39.97,28.32 39.97,39.62 40.73,40.38 44.54,40.38 48.09,43.94 48.09,51.81 43.01,56.89 U2.29
AIN2: length 41.8
  Bottom Layer w0.508: U3.15 38.82,26.92 38.82,40.64 41.11,42.92 44.67,42.92 46.44,44.7 46.44,51.43 43.52,54.35 U2.30
AO1: length 40.6
  Bottom Layer w0.508: CN4.1 16.22,2.53 44.79,2.53 48.73,6.47 U3.4
AO2: length 30.1
  Top Layer w0.508: U3.5 47.71,3.04 28.21,3.04 CN4.6
BIN1: length 18.7
  Bottom Layer w0.508: U3.12 51.27,32.89 54.95,36.57 U2.4
BIN2: length 14.9
  Bottom Layer w0.508: U3.11 53.81,32.51 55.08,33.78 57.37,33.78 U2.3
BO1: length 20.7
  Bottom Layer w0.508: U3.7 58.13,8.38 74.37,8.38 CN5.1
BO2: length 36.4
  Bottom Layer w0.508: U3.6 55.84,4.57 85.56,4.57 85.69,4.44 88.25,7 CN5.6
BRX: length 47.2
  Top Layer w0.508: U2.6 81.5,41.65 U5.5
BTX: length 47.2
  Top Layer w0.508: U2.7 81.5,44.19 U5.4
ENCODERA1: length 63.8
  Bottom Layer w0.508: U2.31 28.16,51.81 19.9,43.56 19.9,10.15 CN4.3
ENCODERA2: length 59.8
  Bottom Layer w0.508: CN4.4 22.44,10.19 22.44,42.92 28.79,49.27 U2.32
ENCODERB1: length 64.6
  Bottom Layer w0.508: U2.14 80.75,38.84 CN5.3
ENCODERB2: length 68.3
  Bottom Layer w0.508: U2.15 83.4,38.73 83.4,7.15 CN5.4
INT: length 58.7
  Top Layer w0.508: U2.2 56.35,30.22 32.09,30.22 9.87,52.45 8.85,52.45 8.72,52.32
MSCL: length 43.4
  Top Layer w0.508: 8.72,65.02 18.76,65.02 18.89,65.15 U2.35
MSDA: length 43.3
  Top Layer w0.508: 8.72,62.48 19.01,62.48 U2.36
OSCL: length 47.9
  Bottom Layer w0.508: U2.16 83.66,67.05 89.88,73.27 89.88,76.45 88.61,77.72 84.16,77.72 83.27,76.83 OLED1.3
OSDA: length 39.8
  Bottom Layer w0.508: OLED1.4 80.99,69.59 80.4,69.59 79.89,70.1 79.89,70.48 79.39,70.99 78.88,70.99 78.37,70.48 78.37,70.1 77.86,69.59 77.35,69.59 76.85,70.1 76.85,70.48 76.34,70.99 75.83,70.99 75.32,70.48 75.32,70.1 74.81,69.59 74.31,69.59 73.8,70.1 73.8,70.48 73.29,70.99 72.78,70.99 72.27,70.48 72.27,70.1 71.77,69.59 71.26,69.59 70.75,70.1 70.75,70.48 70.24,70.99 69.73,70.99 69.23,70.48 69.23,70.1 68.72,69.59 68.21,69.59 67.7,70.1 67.7,70.48 67.19,70.99 66.69,70.99 66.18,70.48 66.18,70.1 65.67,69.59 65.16,69.59 64.65,70.1 64.65,70.48 64.15,70.99 63.64,70.99 63.13,70.48 63.13,70.1 62.62,69.59 U2.17
PWMA: length 54.2
  Bottom Layer w0.508: U3.16 36.79,26.41 36.79,41.78 40.47,45.46 43.4,45.46 44.67,46.73 44.67,51.56 43.14,53.08 40.86,53.08 39.08,54.86 39.08,61.21 U2.26
PWMB: length 59.2
  Bottom Layer w0.508: U3.10 63.46,29.2 63.46,53.97 59.27,58.16 56.1,58.16 52.29,61.97 U2.27
VO: length 47.8
  Top Layer w1.27: U3.1 31.66,6.6 U4.2 U4.2 7.82,32.97 SW1.2
VUSE: length 184.8
  Top Layer w1: U5.2 96.99,32.76 U2.18 59.02,72.13 61.05,74.16 61.05,76.96 59.27,78.73 31.84,78.73 29.55,76.45 11.14,76.45 3.64,68.96 3.64,54.55 32.2,26 U4.4 U4.4

## Copper pours and planes (outline as drawn; the poured copper is in the pictures)
GND on Top Layer: -68.87,83.43 146.9,83.43 146.9,-5.97 -68.87,-5.97
GND on Bottom Layer: -5.75,106.29 105.5,106.29 105.5,-28.07 -5.75,-28.07

Small or netless copper shapes (teardrops, artwork), in the pictures only: 32 on Top Layer, 41 on Bottom Layer

## Text on the board
Top Layer: LMZ出品
